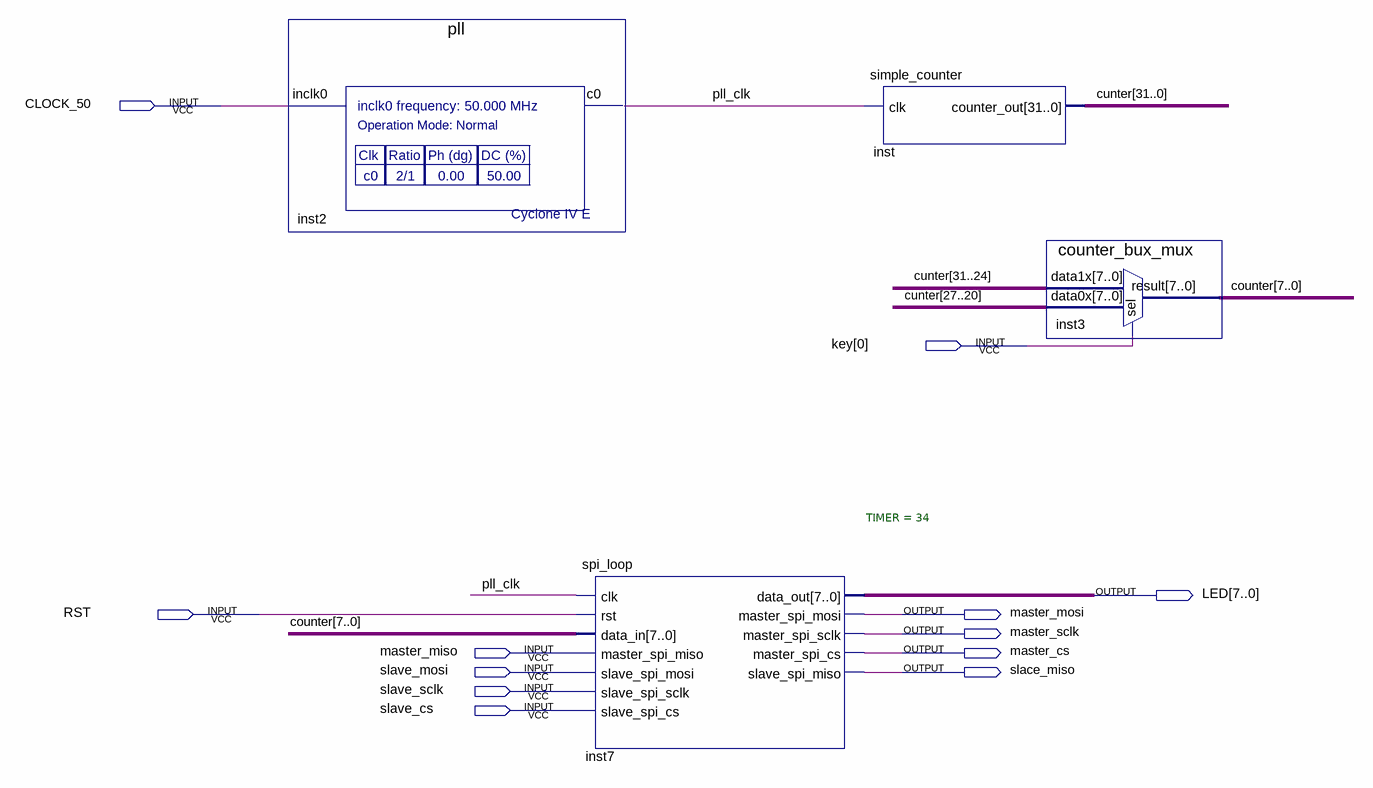
[diagram p0: schematic sheet]
// Quartus schematic play.bdf as structural Verilog: 4 symbols, 12 pins
module play (
  input  CLOCK_50,
  input  [0:0] key,
  input  RST,
  input  master_miso,
  input  slave_mosi,
  input  slave_sclk,
  input  slave_cs,
  output [7:0] LED,
  output master_mosi,
  output master_sclk,
  output master_cs,
  output slace_miso
);

  wire pll_clk;
  wire [7:0] counter;
  wire [31:0] cunter;

  pll inst2 (.inclk0(CLOCK_50), .c0(pll_clk));
  spi_loop #(.TIMER(34)) inst7 (
    .clk(pll_clk), .rst(RST), .data_in(counter), .master_spi_miso(master_miso), .slave_spi_mosi(slave_mosi),
    .slave_spi_sclk(slave_sclk), .slave_spi_cs(slave_cs), .data_out(LED), .master_spi_mosi(master_mosi),
    .master_spi_sclk(master_sclk), .master_spi_cs(master_cs), .slave_spi_miso(slace_miso));
  simple_counter inst (.clk(pll_clk), .counter_out(cunter));
  counter_bux_mux inst3 (.data1x(cunter[31:24]), .data0x(cunter[27:20]), .sel(key[0]), .result(counter));
endmodule
